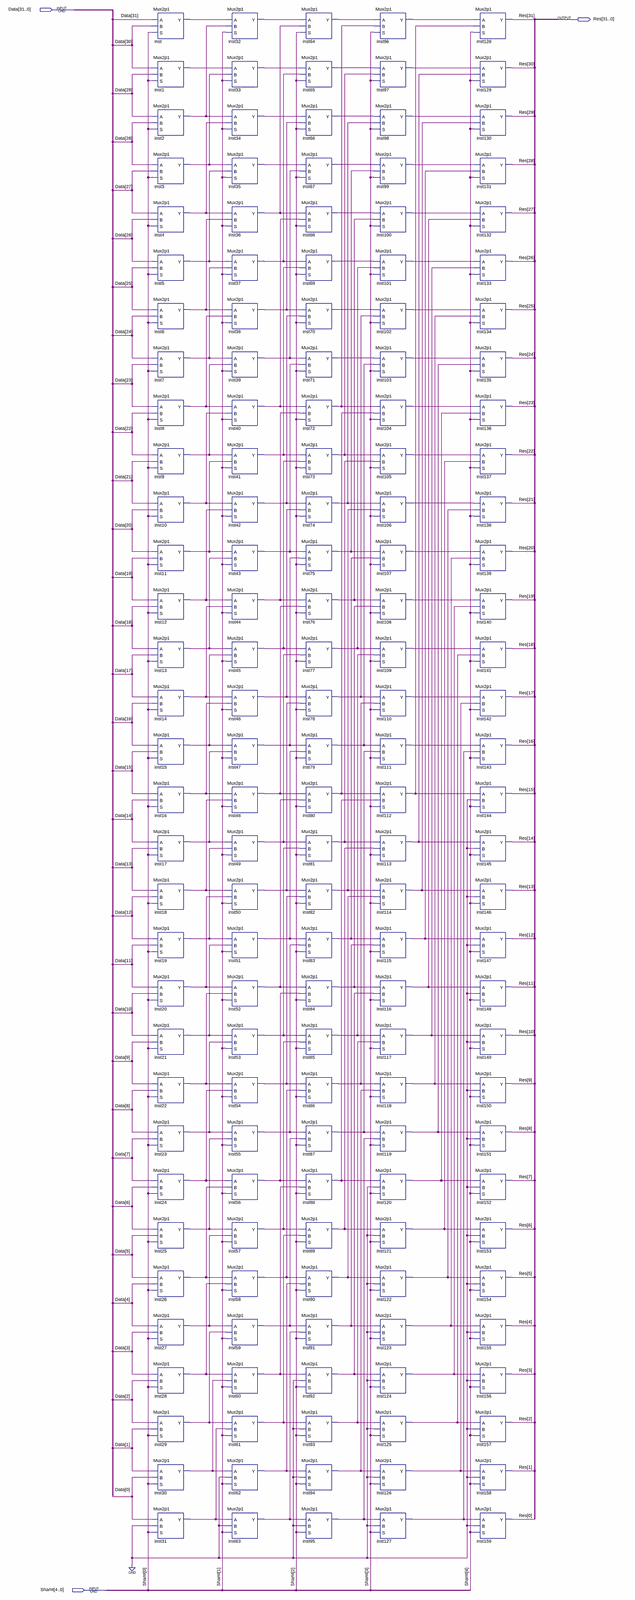
[diagram p0: schematic sheet, whole]
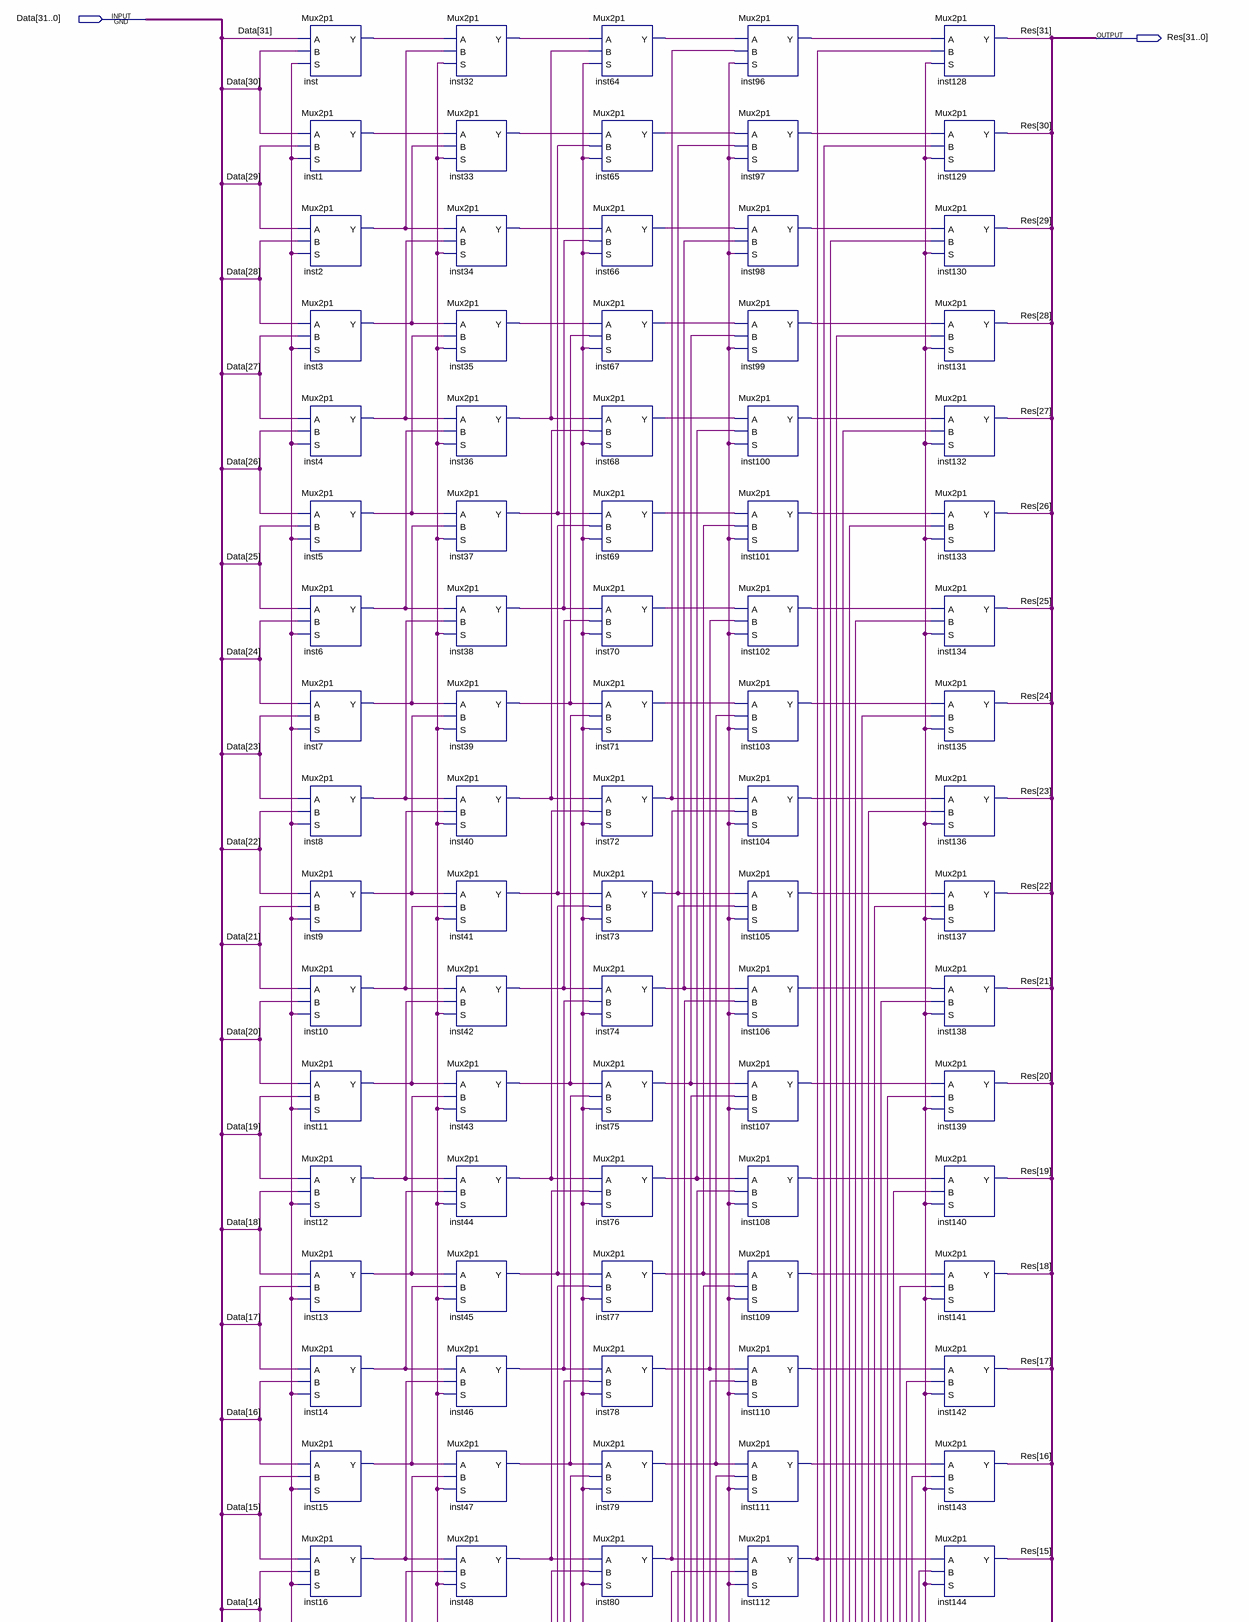
[diagram p1: schematic sheet, upper part]
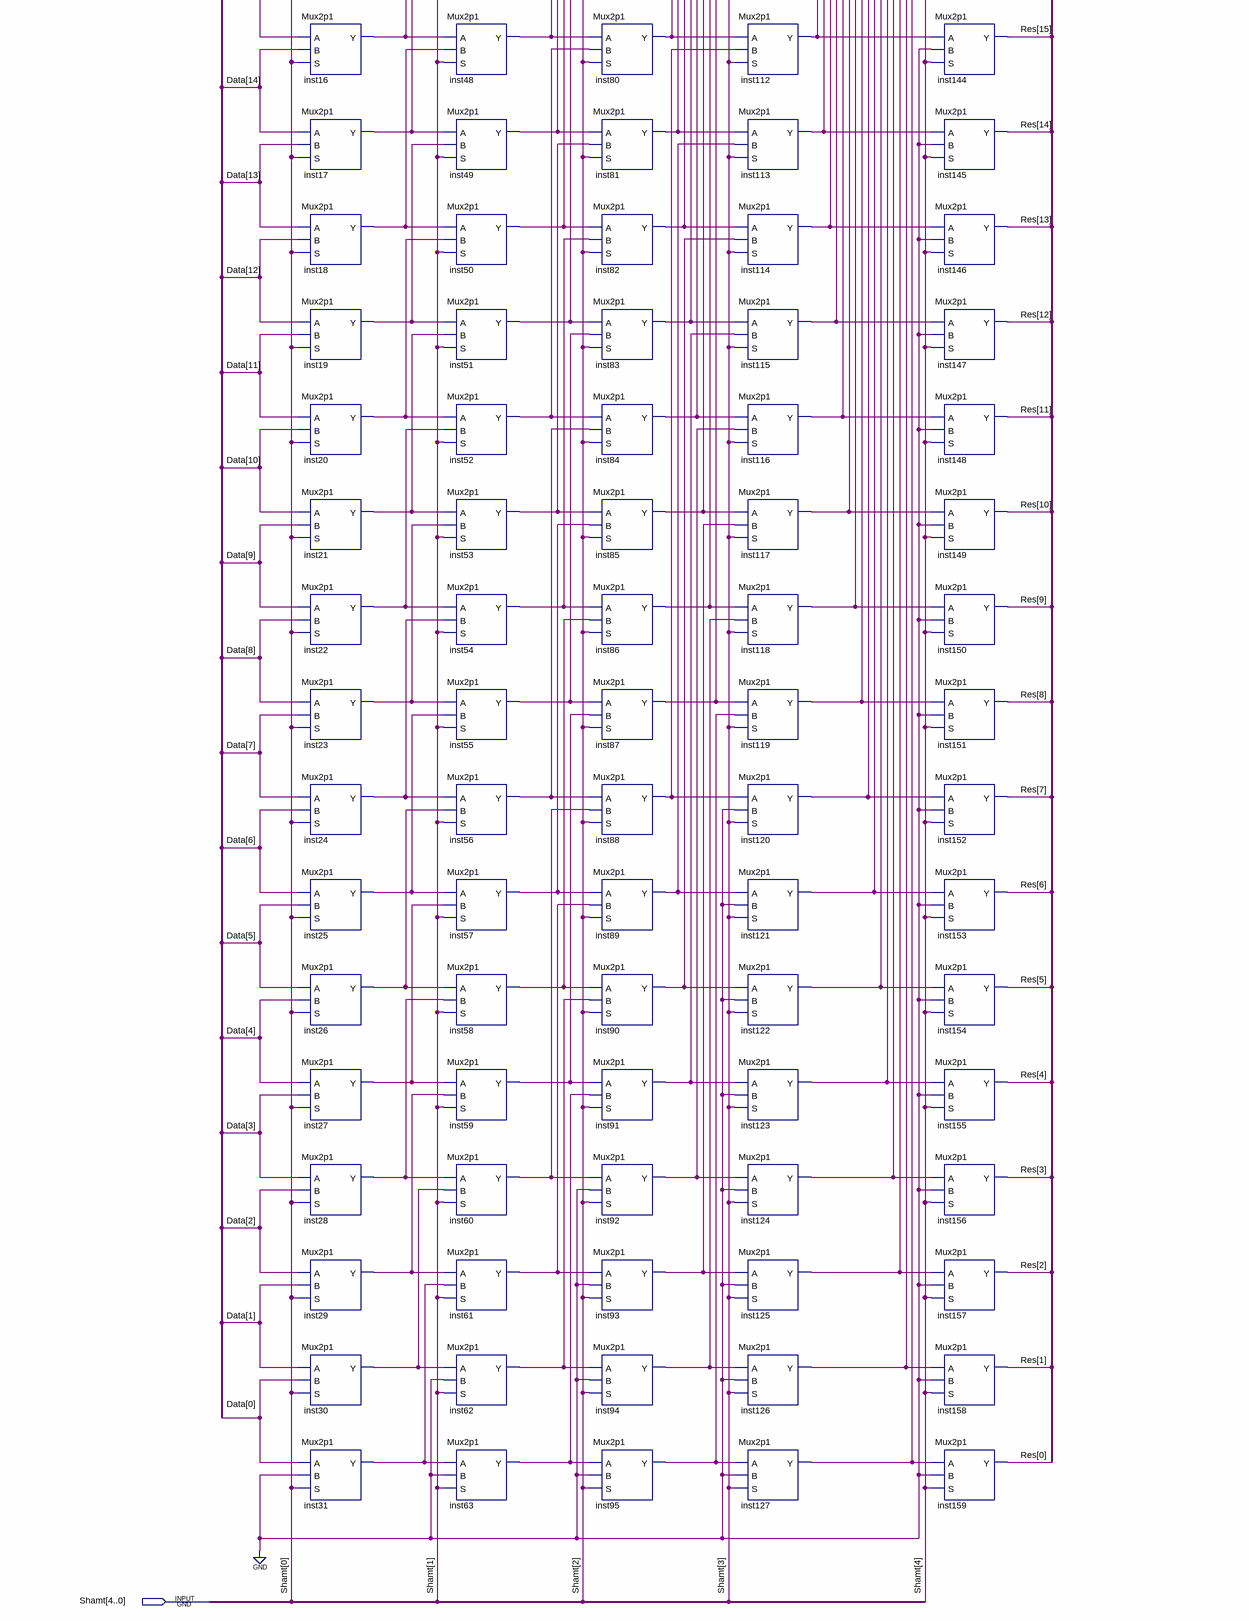
[diagram p2: schematic sheet, lower part]
// Quartus schematic Barrel_shifter.bdf as structural Verilog: 160 symbols, 3 pins
module Barrel_shifter (
  input  [31:0] Data,
  input  [4:0] Shamt,
  output [31:0] Res
);

  wire inst1_y, inst2_y, inst3_y, inst4_y, inst5_y, inst6_y, inst7_y, inst8_y, inst9_y, inst10_y, inst11_y,
       inst12_y, inst13_y, inst14_y, inst15_y, inst16_y, inst17_y, inst18_y, inst19_y, inst20_y, inst21_y,
       inst22_y, inst23_y, inst24_y, inst25_y, inst26_y, inst27_y, inst28_y, inst29_y, inst30_y, inst31_y,
       inst32_y, inst33_y, inst34_y, inst35_y, inst36_y, inst37_y, inst38_y, inst39_y, inst40_y, inst41_y,
       inst42_y, inst43_y, inst44_y, inst45_y, inst46_y, inst47_y, inst48_y, inst49_y, inst50_y, inst51_y,
       inst52_y, inst53_y, inst54_y, inst55_y, inst56_y, inst57_y, inst58_y, inst59_y, inst60_y, inst61_y,
       inst62_y, inst63_y, inst64_y, inst65_y, inst66_y, inst67_y, inst68_y, inst69_y, inst70_y, inst71_y,
       inst72_y, inst73_y, inst74_y, inst75_y, inst76_y, inst77_y, inst78_y, inst79_y, inst80_y, inst81_y,
       inst82_y, inst83_y, inst84_y, inst85_y, inst86_y, inst87_y, inst88_y, inst89_y, inst90_y, inst91_y,
       inst92_y, inst93_y, inst94_y, inst95_y, inst96_y, inst97_y, inst98_y, inst99_y, inst100_y, inst101_y,
       inst102_y, inst103_y, inst104_y, inst105_y, inst106_y, inst107_y, inst108_y, inst109_y, inst110_y,
       inst111_y, inst112_y, inst113_y, inst114_y, inst115_y, inst116_y, inst117_y, inst118_y, inst119_y,
       inst120_y, inst121_y, inst122_y, inst123_y, inst124_y, inst125_y, inst126_y, inst127_y, inst_y;

  Mux2p1 inst (.A(Data[31]), .B(Data[30]), .S(Shamt[0]), .Y(inst_y));
  Mux2p1 inst1 (.A(Data[30]), .B(Data[29]), .S(Shamt[0]), .Y(inst1_y));
  Mux2p1 inst2 (.A(Data[29]), .B(Data[28]), .S(Shamt[0]), .Y(inst2_y));
  Mux2p1 inst3 (.A(Data[28]), .B(Data[27]), .S(Shamt[0]), .Y(inst3_y));
  Mux2p1 inst4 (.A(Data[27]), .B(Data[26]), .S(Shamt[0]), .Y(inst4_y));
  Mux2p1 inst5 (.A(Data[26]), .B(Data[25]), .S(Shamt[0]), .Y(inst5_y));
  Mux2p1 inst6 (.A(Data[25]), .B(Data[24]), .S(Shamt[0]), .Y(inst6_y));
  Mux2p1 inst7 (.A(Data[24]), .B(Data[23]), .S(Shamt[0]), .Y(inst7_y));
  Mux2p1 inst8 (.A(Data[23]), .B(Data[22]), .S(Shamt[0]), .Y(inst8_y));
  Mux2p1 inst9 (.A(Data[22]), .B(Data[21]), .S(Shamt[0]), .Y(inst9_y));
  Mux2p1 inst10 (.A(Data[21]), .B(Data[20]), .S(Shamt[0]), .Y(inst10_y));
  Mux2p1 inst11 (.A(Data[20]), .B(Data[19]), .S(Shamt[0]), .Y(inst11_y));
  Mux2p1 inst12 (.A(Data[19]), .B(Data[18]), .S(Shamt[0]), .Y(inst12_y));
  Mux2p1 inst13 (.A(Data[18]), .B(Data[17]), .S(Shamt[0]), .Y(inst13_y));
  Mux2p1 inst14 (.A(Data[17]), .B(Data[16]), .S(Shamt[0]), .Y(inst14_y));
  Mux2p1 inst15 (.A(Data[16]), .B(Data[15]), .S(Shamt[0]), .Y(inst15_y));
  Mux2p1 inst16 (.A(Data[15]), .B(Data[14]), .S(Shamt[0]), .Y(inst16_y));
  Mux2p1 inst17 (.A(Data[14]), .B(Data[13]), .S(Shamt[0]), .Y(inst17_y));
  Mux2p1 inst18 (.A(Data[13]), .B(Data[12]), .S(Shamt[0]), .Y(inst18_y));
  Mux2p1 inst19 (.A(Data[12]), .B(Data[11]), .S(Shamt[0]), .Y(inst19_y));
  Mux2p1 inst20 (.A(Data[11]), .B(Data[10]), .S(Shamt[0]), .Y(inst20_y));
  Mux2p1 inst21 (.A(Data[10]), .B(Data[9]), .S(Shamt[0]), .Y(inst21_y));
  Mux2p1 inst22 (.A(Data[9]), .B(Data[8]), .S(Shamt[0]), .Y(inst22_y));
  Mux2p1 inst23 (.A(Data[8]), .B(Data[7]), .S(Shamt[0]), .Y(inst23_y));
  Mux2p1 inst24 (.A(Data[7]), .B(Data[6]), .S(Shamt[0]), .Y(inst24_y));
  Mux2p1 inst25 (.A(Data[6]), .B(Data[5]), .S(Shamt[0]), .Y(inst25_y));
  Mux2p1 inst26 (.A(Data[5]), .B(Data[4]), .S(Shamt[0]), .Y(inst26_y));
  Mux2p1 inst27 (.A(Data[4]), .B(Data[3]), .S(Shamt[0]), .Y(inst27_y));
  Mux2p1 inst28 (.A(Data[3]), .B(Data[2]), .S(Shamt[0]), .Y(inst28_y));
  Mux2p1 inst29 (.A(Data[2]), .B(Data[1]), .S(Shamt[0]), .Y(inst29_y));
  Mux2p1 inst30 (.A(Data[1]), .B(Data[0]), .S(Shamt[0]), .Y(inst30_y));
  Mux2p1 inst31 (.A(Data[0]), .B(1'b0), .S(Shamt[0]), .Y(inst31_y));
  Mux2p1 inst32 (.A(inst_y), .B(inst2_y), .S(Shamt[1]), .Y(inst32_y));
  Mux2p1 inst33 (.A(inst1_y), .B(inst3_y), .S(Shamt[1]), .Y(inst33_y));
  Mux2p1 inst34 (.A(inst2_y), .B(inst4_y), .S(Shamt[1]), .Y(inst34_y));
  Mux2p1 inst35 (.A(inst3_y), .B(inst5_y), .S(Shamt[1]), .Y(inst35_y));
  Mux2p1 inst36 (.A(inst4_y), .B(inst6_y), .S(Shamt[1]), .Y(inst36_y));
  Mux2p1 inst37 (.A(inst5_y), .B(inst7_y), .S(Shamt[1]), .Y(inst37_y));
  Mux2p1 inst38 (.A(inst6_y), .B(inst8_y), .S(Shamt[1]), .Y(inst38_y));
  Mux2p1 inst39 (.A(inst7_y), .B(inst9_y), .S(Shamt[1]), .Y(inst39_y));
  Mux2p1 inst40 (.A(inst8_y), .B(inst10_y), .S(Shamt[1]), .Y(inst40_y));
  Mux2p1 inst41 (.A(inst9_y), .B(inst11_y), .S(Shamt[1]), .Y(inst41_y));
  Mux2p1 inst42 (.A(inst10_y), .B(inst12_y), .S(Shamt[1]), .Y(inst42_y));
  Mux2p1 inst43 (.A(inst11_y), .B(inst13_y), .S(Shamt[1]), .Y(inst43_y));
  Mux2p1 inst44 (.A(inst12_y), .B(inst14_y), .S(Shamt[1]), .Y(inst44_y));
  Mux2p1 inst45 (.A(inst13_y), .B(inst15_y), .S(Shamt[1]), .Y(inst45_y));
  Mux2p1 inst46 (.A(inst14_y), .B(inst16_y), .S(Shamt[1]), .Y(inst46_y));
  Mux2p1 inst47 (.A(inst15_y), .B(inst17_y), .S(Shamt[1]), .Y(inst47_y));
  Mux2p1 inst48 (.A(inst16_y), .B(inst18_y), .S(Shamt[1]), .Y(inst48_y));
  Mux2p1 inst49 (.A(inst17_y), .B(inst19_y), .S(Shamt[1]), .Y(inst49_y));
  Mux2p1 inst50 (.A(inst18_y), .B(inst20_y), .S(Shamt[1]), .Y(inst50_y));
  Mux2p1 inst51 (.A(inst19_y), .B(inst21_y), .S(Shamt[1]), .Y(inst51_y));
  Mux2p1 inst52 (.A(inst20_y), .B(inst22_y), .S(Shamt[1]), .Y(inst52_y));
  Mux2p1 inst53 (.A(inst21_y), .B(inst23_y), .S(Shamt[1]), .Y(inst53_y));
  Mux2p1 inst54 (.A(inst22_y), .B(inst24_y), .S(Shamt[1]), .Y(inst54_y));
  Mux2p1 inst55 (.A(inst23_y), .B(inst25_y), .S(Shamt[1]), .Y(inst55_y));
  Mux2p1 inst56 (.A(inst24_y), .B(inst26_y), .S(Shamt[1]), .Y(inst56_y));
  Mux2p1 inst57 (.A(inst25_y), .B(inst27_y), .S(Shamt[1]), .Y(inst57_y));
  Mux2p1 inst58 (.A(inst26_y), .B(inst28_y), .S(Shamt[1]), .Y(inst58_y));
  Mux2p1 inst59 (.A(inst27_y), .B(inst29_y), .S(Shamt[1]), .Y(inst59_y));
  Mux2p1 inst60 (.A(inst28_y), .B(inst30_y), .S(Shamt[1]), .Y(inst60_y));
  Mux2p1 inst61 (.A(inst29_y), .B(inst31_y), .S(Shamt[1]), .Y(inst61_y));
  Mux2p1 inst62 (.A(inst30_y), .B(1'b0), .S(Shamt[1]), .Y(inst62_y));
  Mux2p1 inst63 (.A(inst31_y), .B(1'b0), .S(Shamt[1]), .Y(inst63_y));
  Mux2p1 inst64 (.A(inst32_y), .B(inst36_y), .S(Shamt[2]), .Y(inst64_y));
  Mux2p1 inst65 (.A(inst33_y), .B(inst37_y), .S(Shamt[2]), .Y(inst65_y));
  Mux2p1 inst66 (.A(inst34_y), .B(inst38_y), .S(Shamt[2]), .Y(inst66_y));
  Mux2p1 inst67 (.A(inst35_y), .B(inst39_y), .S(Shamt[2]), .Y(inst67_y));
  Mux2p1 inst68 (.A(inst36_y), .B(inst40_y), .S(Shamt[2]), .Y(inst68_y));
  Mux2p1 inst69 (.A(inst37_y), .B(inst41_y), .S(Shamt[2]), .Y(inst69_y));
  Mux2p1 inst70 (.A(inst38_y), .B(inst42_y), .S(Shamt[2]), .Y(inst70_y));
  Mux2p1 inst71 (.A(inst39_y), .B(inst43_y), .S(Shamt[2]), .Y(inst71_y));
  Mux2p1 inst72 (.A(inst40_y), .B(inst44_y), .S(Shamt[2]), .Y(inst72_y));
  Mux2p1 inst73 (.A(inst41_y), .B(inst45_y), .S(Shamt[2]), .Y(inst73_y));
  Mux2p1 inst74 (.A(inst42_y), .B(inst46_y), .S(Shamt[2]), .Y(inst74_y));
  Mux2p1 inst75 (.A(inst43_y), .B(inst47_y), .S(Shamt[2]), .Y(inst75_y));
  Mux2p1 inst76 (.A(inst44_y), .B(inst48_y), .S(Shamt[2]), .Y(inst76_y));
  Mux2p1 inst77 (.A(inst45_y), .B(inst49_y), .S(Shamt[2]), .Y(inst77_y));
  Mux2p1 inst78 (.A(inst46_y), .B(inst50_y), .S(Shamt[2]), .Y(inst78_y));
  Mux2p1 inst79 (.A(inst47_y), .B(inst51_y), .S(Shamt[2]), .Y(inst79_y));
  Mux2p1 inst80 (.A(inst48_y), .B(inst52_y), .S(Shamt[2]), .Y(inst80_y));
  Mux2p1 inst81 (.A(inst49_y), .B(inst53_y), .S(Shamt[2]), .Y(inst81_y));
  Mux2p1 inst82 (.A(inst50_y), .B(inst54_y), .S(Shamt[2]), .Y(inst82_y));
  Mux2p1 inst83 (.A(inst51_y), .B(inst55_y), .S(Shamt[2]), .Y(inst83_y));
  Mux2p1 inst84 (.A(inst52_y), .B(inst56_y), .S(Shamt[2]), .Y(inst84_y));
  Mux2p1 inst85 (.A(inst53_y), .B(inst57_y), .S(Shamt[2]), .Y(inst85_y));
  Mux2p1 inst86 (.A(inst54_y), .B(inst58_y), .S(Shamt[2]), .Y(inst86_y));
  Mux2p1 inst87 (.A(inst55_y), .B(inst59_y), .S(Shamt[2]), .Y(inst87_y));
  Mux2p1 inst88 (.A(inst56_y), .B(inst60_y), .S(Shamt[2]), .Y(inst88_y));
  Mux2p1 inst89 (.A(inst57_y), .B(inst61_y), .S(Shamt[2]), .Y(inst89_y));
  Mux2p1 inst90 (.A(inst58_y), .B(inst62_y), .S(Shamt[2]), .Y(inst90_y));
  Mux2p1 inst91 (.A(inst59_y), .B(inst63_y), .S(Shamt[2]), .Y(inst91_y));
  Mux2p1 inst92 (.A(inst60_y), .B(1'b0), .S(Shamt[2]), .Y(inst92_y));
  Mux2p1 inst93 (.A(inst61_y), .B(1'b0), .S(Shamt[2]), .Y(inst93_y));
  Mux2p1 inst94 (.A(inst62_y), .B(1'b0), .S(Shamt[2]), .Y(inst94_y));
  Mux2p1 inst95 (.A(inst63_y), .B(1'b0), .S(Shamt[2]), .Y(inst95_y));
  Mux2p1 inst96 (.A(inst64_y), .B(inst72_y), .S(Shamt[3]), .Y(inst96_y));
  Mux2p1 inst97 (.A(inst65_y), .B(inst73_y), .S(Shamt[3]), .Y(inst97_y));
  Mux2p1 inst98 (.A(inst66_y), .B(inst74_y), .S(Shamt[3]), .Y(inst98_y));
  Mux2p1 inst99 (.A(inst67_y), .B(inst75_y), .S(Shamt[3]), .Y(inst99_y));
  Mux2p1 inst100 (.A(inst68_y), .B(inst76_y), .S(Shamt[3]), .Y(inst100_y));
  Mux2p1 inst101 (.A(inst69_y), .B(inst77_y), .S(Shamt[3]), .Y(inst101_y));
  Mux2p1 inst102 (.A(inst70_y), .B(inst78_y), .S(Shamt[3]), .Y(inst102_y));
  Mux2p1 inst103 (.A(inst71_y), .B(inst79_y), .S(Shamt[3]), .Y(inst103_y));
  Mux2p1 inst104 (.A(inst72_y), .B(inst80_y), .S(Shamt[3]), .Y(inst104_y));
  Mux2p1 inst105 (.A(inst73_y), .B(inst81_y), .S(Shamt[3]), .Y(inst105_y));
  Mux2p1 inst106 (.A(inst74_y), .B(inst82_y), .S(Shamt[3]), .Y(inst106_y));
  Mux2p1 inst107 (.A(inst75_y), .B(inst83_y), .S(Shamt[3]), .Y(inst107_y));
  Mux2p1 inst108 (.A(inst76_y), .B(inst84_y), .S(Shamt[3]), .Y(inst108_y));
  Mux2p1 inst109 (.A(inst77_y), .B(inst85_y), .S(Shamt[3]), .Y(inst109_y));
  Mux2p1 inst110 (.A(inst78_y), .B(inst86_y), .S(Shamt[3]), .Y(inst110_y));
  Mux2p1 inst111 (.A(inst79_y), .B(inst87_y), .S(Shamt[3]), .Y(inst111_y));
  Mux2p1 inst112 (.A(inst80_y), .B(inst88_y), .S(Shamt[3]), .Y(inst112_y));
  Mux2p1 inst113 (.A(inst81_y), .B(inst89_y), .S(Shamt[3]), .Y(inst113_y));
  Mux2p1 inst114 (.A(inst82_y), .B(inst90_y), .S(Shamt[3]), .Y(inst114_y));
  Mux2p1 inst115 (.A(inst83_y), .B(inst91_y), .S(Shamt[3]), .Y(inst115_y));
  Mux2p1 inst116 (.A(inst84_y), .B(inst92_y), .S(Shamt[3]), .Y(inst116_y));
  Mux2p1 inst117 (.A(inst85_y), .B(inst93_y), .S(Shamt[3]), .Y(inst117_y));
  Mux2p1 inst118 (.A(inst86_y), .B(inst94_y), .S(Shamt[3]), .Y(inst118_y));
  Mux2p1 inst119 (.A(inst87_y), .B(inst95_y), .S(Shamt[3]), .Y(inst119_y));
  Mux2p1 inst120 (.A(inst88_y), .B(1'b0), .S(Shamt[3]), .Y(inst120_y));
  Mux2p1 inst121 (.A(inst89_y), .B(1'b0), .S(Shamt[3]), .Y(inst121_y));
  Mux2p1 inst122 (.A(inst90_y), .B(1'b0), .S(Shamt[3]), .Y(inst122_y));
  Mux2p1 inst123 (.A(inst91_y), .B(1'b0), .S(Shamt[3]), .Y(inst123_y));
  Mux2p1 inst124 (.A(inst92_y), .B(1'b0), .S(Shamt[3]), .Y(inst124_y));
  Mux2p1 inst125 (.A(inst93_y), .B(1'b0), .S(Shamt[3]), .Y(inst125_y));
  Mux2p1 inst126 (.A(inst94_y), .B(1'b0), .S(Shamt[3]), .Y(inst126_y));
  Mux2p1 inst127 (.A(inst95_y), .B(1'b0), .S(Shamt[3]), .Y(inst127_y));
  Mux2p1 inst128 (.A(inst96_y), .B(inst112_y), .S(Shamt[4]), .Y(Res[31]));
  Mux2p1 inst129 (.A(inst97_y), .B(inst113_y), .S(Shamt[4]), .Y(Res[30]));
  Mux2p1 inst130 (.A(inst98_y), .B(inst114_y), .S(Shamt[4]), .Y(Res[29]));
  Mux2p1 inst131 (.A(inst99_y), .B(inst115_y), .S(Shamt[4]), .Y(Res[28]));
  Mux2p1 inst132 (.A(inst100_y), .B(inst116_y), .S(Shamt[4]), .Y(Res[27]));
  Mux2p1 inst133 (.A(inst101_y), .B(inst117_y), .S(Shamt[4]), .Y(Res[26]));
  Mux2p1 inst134 (.A(inst102_y), .B(inst118_y), .S(Shamt[4]), .Y(Res[25]));
  Mux2p1 inst135 (.A(inst103_y), .B(inst119_y), .S(Shamt[4]), .Y(Res[24]));
  Mux2p1 inst136 (.A(inst104_y), .B(inst120_y), .S(Shamt[4]), .Y(Res[23]));
  Mux2p1 inst137 (.A(inst105_y), .B(inst121_y), .S(Shamt[4]), .Y(Res[22]));
  Mux2p1 inst138 (.A(inst106_y), .B(inst122_y), .S(Shamt[4]), .Y(Res[21]));
  Mux2p1 inst139 (.A(inst107_y), .B(inst123_y), .S(Shamt[4]), .Y(Res[20]));
  Mux2p1 inst140 (.A(inst108_y), .B(inst124_y), .S(Shamt[4]), .Y(Res[19]));
  Mux2p1 inst141 (.A(inst109_y), .B(inst125_y), .S(Shamt[4]), .Y(Res[18]));
  Mux2p1 inst142 (.A(inst110_y), .B(inst126_y), .S(Shamt[4]), .Y(Res[17]));
  Mux2p1 inst143 (.A(inst111_y), .B(inst127_y), .S(Shamt[4]), .Y(Res[16]));
  Mux2p1 inst144 (.A(inst112_y), .B(1'b0), .S(Shamt[4]), .Y(Res[15]));
  Mux2p1 inst145 (.A(inst113_y), .B(1'b0), .S(Shamt[4]), .Y(Res[14]));
  Mux2p1 inst146 (.A(inst114_y), .B(1'b0), .S(Shamt[4]), .Y(Res[13]));
  Mux2p1 inst147 (.A(inst115_y), .B(1'b0), .S(Shamt[4]), .Y(Res[12]));
  Mux2p1 inst148 (.A(inst116_y), .B(1'b0), .S(Shamt[4]), .Y(Res[11]));
  Mux2p1 inst149 (.A(inst117_y), .B(1'b0), .S(Shamt[4]), .Y(Res[10]));
  Mux2p1 inst150 (.A(inst118_y), .B(1'b0), .S(Shamt[4]), .Y(Res[9]));
  Mux2p1 inst151 (.A(inst119_y), .B(1'b0), .S(Shamt[4]), .Y(Res[8]));
  Mux2p1 inst152 (.A(inst120_y), .B(1'b0), .S(Shamt[4]), .Y(Res[7]));
  Mux2p1 inst153 (.A(inst121_y), .B(1'b0), .S(Shamt[4]), .Y(Res[6]));
  Mux2p1 inst154 (.A(inst122_y), .B(1'b0), .S(Shamt[4]), .Y(Res[5]));
  Mux2p1 inst155 (.A(inst123_y), .B(1'b0), .S(Shamt[4]), .Y(Res[4]));
  Mux2p1 inst156 (.A(inst124_y), .B(1'b0), .S(Shamt[4]), .Y(Res[3]));
  Mux2p1 inst157 (.A(inst125_y), .B(1'b0), .S(Shamt[4]), .Y(Res[2]));
  Mux2p1 inst158 (.A(inst126_y), .B(1'b0), .S(Shamt[4]), .Y(Res[1]));
  Mux2p1 inst159 (.A(inst127_y), .B(1'b0), .S(Shamt[4]), .Y(Res[0]));
endmodule
